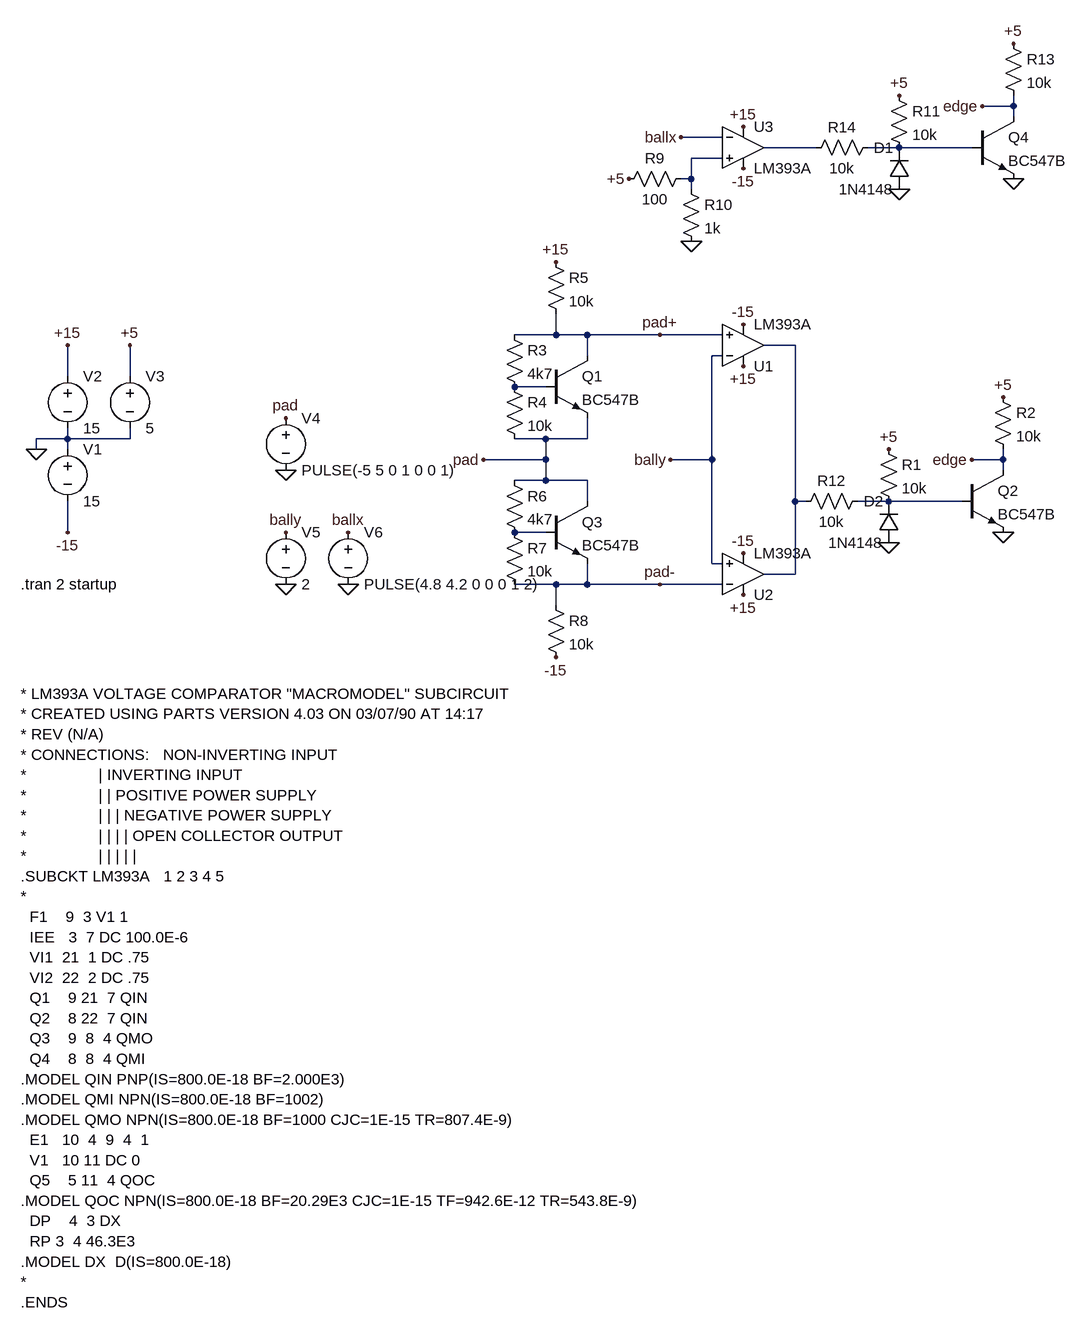
[diagram p0: schematic pad_area.asc]
pad_area.asc, the LTspice schematic file:
Version 4
SHEET 1 1728 1700
WIRE 1280 -368 1280 -384
WIRE 1280 -368 1232 -368
WIRE 1280 -352 1280 -368
WIRE 832 -320 768 -320
WIRE 976 -304 896 -304
WIRE 1104 -304 1056 -304
WIRE 1216 -304 1104 -304
WIRE 832 -288 784 -288
WIRE 784 -256 784 -288
WIRE 784 -256 768 -256
WIRE 784 -240 784 -256
WIRE 576 -16 576 -48
WIRE 576 -16 512 -16
WIRE 624 -16 576 -16
WIRE 736 -16 624 -16
WIRE 832 -16 736 -16
WIRE 944 0 896 0
WIRE 624 16 624 -16
WIRE 832 16 816 16
WIRE -176 48 -176 0
WIRE -80 48 -80 0
WIRE 560 64 512 64
WIRE -176 144 -176 128
WIRE -176 144 -224 144
WIRE -80 144 -80 128
WIRE -80 144 -176 144
WIRE 560 144 512 144
WIRE 624 144 624 112
WIRE 624 144 560 144
WIRE -224 160 -224 144
WIRE -176 160 -176 144
WIRE 560 176 560 144
WIRE 560 176 464 176
WIRE 816 176 816 16
WIRE 816 176 752 176
WIRE 1264 176 1264 160
WIRE 1264 176 1216 176
WIRE 1264 192 1264 176
WIRE 560 208 560 176
WIRE 560 208 512 208
WIRE 624 208 560 208
WIRE 624 240 624 208
WIRE 944 240 944 0
WIRE 960 240 944 240
WIRE 1088 240 1040 240
WIRE 1200 240 1088 240
WIRE -176 288 -176 240
WIRE 560 288 512 288
WIRE 816 336 816 176
WIRE 832 336 816 336
WIRE 944 352 944 240
WIRE 944 352 896 352
WIRE 576 368 512 368
WIRE 624 368 624 336
WIRE 624 368 576 368
WIRE 736 368 624 368
WIRE 832 368 736 368
WIRE 576 400 576 368
FLAG -224 160 0
FLAG -176 0 +15
FLAG -176 288 -15
FLAG 864 320 -15
FLAG 864 -32 -15
FLAG 864 32 +15
FLAG 864 384 +15
FLAG 1264 288 0
FLAG -80 0 +5
FLAG 1088 160 +5
FLAG 1264 80 +5
FLAG 576 -128 +15
FLAG 576 480 -15
FLAG 464 176 pad
FLAG 752 176 bally
FLAG 1216 176 edge
FLAG 160 192 0
FLAG 160 112 pad
FLAG 160 368 0
FLAG 160 288 bally
FLAG 736 -16 pad+
FLAG 736 368 pad-
FLAG 864 -272 -15
FLAG 864 -336 +15
FLAG 768 -320 ballx
FLAG 256 368 0
FLAG 256 288 ballx
FLAG 784 -160 0
FLAG 688 -256 +5
FLAG 1088 304 0
FLAG 1280 -256 0
FLAG 1104 -384 +5
FLAG 1280 -464 +5
FLAG 1232 -368 edge
FLAG 1104 -240 0
SYMBOL voltage -176 144 R0
SYMATTR InstName V1
SYMATTR Value 15
SYMBOL voltage -176 32 R0
SYMATTR InstName V2
SYMATTR Value 15
SYMBOL npn 560 16 R0
SYMATTR InstName Q1
SYMATTR Value BC547B
SYMBOL Opamps\\opamp2 864 64 M180
SYMATTR InstName U1
SYMATTR Value LM393A
SYMBOL Opamps\\opamp2 864 416 M180
SYMATTR InstName U2
SYMATTR Value LM393A
SYMBOL npn 1200 192 R0
SYMATTR InstName Q2
SYMATTR Value BC547B
SYMBOL res 1072 144 R0
SYMATTR InstName R1
SYMATTR Value 10k
SYMBOL voltage -80 32 R0
SYMATTR InstName V3
SYMATTR Value 5
SYMBOL res 1248 64 R0
SYMATTR InstName R2
SYMATTR Value 10k
SYMBOL res 496 -32 R0
SYMATTR InstName R3
SYMATTR Value 4k7
SYMBOL res 496 48 R0
SYMATTR InstName R4
SYMATTR Value 10k
SYMBOL res 560 -144 R0
SYMATTR InstName R5
SYMATTR Value 10k
SYMBOL npn 560 240 R0
SYMATTR InstName Q3
SYMATTR Value BC547B
SYMBOL res 496 192 R0
SYMATTR InstName R6
SYMATTR Value 4k7
SYMBOL res 496 272 R0
SYMATTR InstName R7
SYMATTR Value 10k
SYMBOL res 560 384 R0
SYMATTR InstName R8
SYMATTR Value 10k
SYMBOL voltage 160 96 R0
WINDOW 123 0 0 Left 0
WINDOW 39 0 0 Left 0
SYMATTR InstName V4
SYMATTR Value PULSE(-5 5 0 1 0 0 1)
SYMBOL voltage 160 272 R0
SYMATTR InstName V5
SYMATTR Value 2
SYMBOL Opamps\\opamp2 864 -368 R0
SYMATTR InstName U3
SYMATTR Value LM393A
SYMBOL voltage 256 272 R0
WINDOW 123 0 0 Left 0
WINDOW 39 0 0 Left 0
SYMATTR InstName V6
SYMATTR Value PULSE(4.8 4.2 0 0 0 1 2)
SYMBOL res 784 -272 R90
WINDOW 0 0 56 VBottom 2
WINDOW 3 32 56 VTop 2
SYMATTR InstName R9
SYMATTR Value 100
SYMBOL res 768 -256 R0
SYMATTR InstName R10
SYMATTR Value 1k
SYMBOL diode 1104 304 R180
WINDOW 0 24 64 Left 2
WINDOW 3 24 0 Left 2
SYMATTR InstName D2
SYMATTR Value 1N4148
SYMBOL res 1056 224 R90
WINDOW 0 0 56 VBottom 2
WINDOW 3 32 56 VTop 2
SYMATTR InstName R12
SYMATTR Value 10k
SYMBOL npn 1216 -352 R0
SYMATTR InstName Q4
SYMATTR Value BC547B
SYMBOL res 1088 -400 R0
SYMATTR InstName R11
SYMATTR Value 10k
SYMBOL res 1264 -480 R0
SYMATTR InstName R13
SYMATTR Value 10k
SYMBOL diode 1120 -240 R180
WINDOW 0 24 64 Left 2
WINDOW 3 24 0 Left 2
SYMATTR InstName D1
SYMATTR Value 1N4148
SYMBOL res 1072 -320 R90
WINDOW 0 0 56 VBottom 2
WINDOW 3 32 56 VTop 2
SYMATTR InstName R14
SYMATTR Value 10k
TEXT -248 368 Left 2 !.tran 2 startup
TEXT -248 536 Left 2 !* LM393A VOLTAGE COMPARATOR "MACROMODEL" SUBCIRCUIT\n* CREATED USING PARTS VERSION 4.03 ON 03/07/90 AT 14:17\n* REV (N/A)\n* CONNECTIONS:   NON-INVERTING INPUT\n*                | INVERTING INPUT\n*                | | POSITIVE POWER SUPPLY\n*                | | | NEGATIVE POWER SUPPLY\n*                | | | | OPEN COLLECTOR OUTPUT\n*                | | | | |\n.SUBCKT LM393A   1 2 3 4 5\n*\n  F1    9  3 V1 1\n  IEE   3  7 DC 100.0E-6\n  VI1  21  1 DC .75\n  VI2  22  2 DC .75\n  Q1    9 21  7 QIN\n  Q2    8 22  7 QIN\n  Q3    9  8  4 QMO\n  Q4    8  8  4 QMI\n.MODEL QIN PNP(IS=800.0E-18 BF=2.000E3)\n.MODEL QMI NPN(IS=800.0E-18 BF=1002)\n.MODEL QMO NPN(IS=800.0E-18 BF=1000 CJC=1E-15 TR=807.4E-9)\n  E1   10  4  9  4  1\n  V1   10 11 DC 0\n  Q5    5 11  4 QOC\n.MODEL QOC NPN(IS=800.0E-18 BF=20.29E3 CJC=1E-15 TF=942.6E-12 TR=543.8E-9)\n  DP    4  3 DX\n  RP 3  4 46.3E3\n.MODEL DX  D(IS=800.0E-18)\n*\n.ENDS

The netlist it stands for:
* pad_area.asc
V1 0 -15 15
V2 +15 0 15
Q1 pad+ N005 pad 0 BC547B
XU1 pad+ bally +15 -15 N004 LM393A  ; pins In+ In- V+ V- OUT
XU2 bally pad- +15 -15 N004 LM393A  ; pins In+ In- V+ V- OUT
Q2 edge N006 0 0 BC547B
R1 +5 N006 10k
V3 +5 0 5
R2 +5 edge 10k
R3 pad+ N005 4k7
R4 N005 pad 10k
R5 +15 pad+ 10k
Q3 pad N007 pad- 0 BC547B
R6 pad N007 4k7
R7 N007 pad- 10k
R8 pad- -15 10k
V4 pad 0 PULSE(-5 5 0 1 0 0 1)
V5 bally 0 2
XU3 N003 ballx +15 -15 N001 LM393A  ; pins In+ In- V+ V- OUT
V6 ballx 0 PULSE(4.8 4.2 0 0 0 1 2)
R9 N003 +5 100
R10 N003 0 1k
D2 0 N006 1N4148
R12 N006 N004 10k
Q4 edge N002 0 0 BC547B
R11 +5 N002 10k
R13 +5 edge 10k
D1 0 N002 1N4148
R14 N002 N001 10k
.model D D
.lib standard.dio
.model NPN NPN
.model PNP PNP
.lib standard.bjt
.tran 2 startup
* LM393A VOLTAGE COMPARATOR "MACROMODEL" SUBCIRCUIT
* CREATED USING PARTS VERSION 4.03 ON 03/07/90 AT 14:17
* REV (N/A)
* CONNECTIONS:   NON-INVERTING INPUT
*                | INVERTING INPUT
*                | | POSITIVE POWER SUPPLY
*                | | | NEGATIVE POWER SUPPLY
*                | | | | OPEN COLLECTOR OUTPUT
*                | | | | |
.SUBCKT LM393A   1 2 3 4 5
*
  F1    9  3 V1 1
  IEE   3  7 DC 100.0E-6
  VI1  21  1 DC .75
  VI2  22  2 DC .75
  Q1    9 21  7 QIN
  Q2    8 22  7 QIN
  Q3    9  8  4 QMO
  Q4    8  8  4 QMI
.MODEL QIN PNP(IS=800.0E-18 BF=2.000E3)
.MODEL QMI NPN(IS=800.0E-18 BF=1002)
.MODEL QMO NPN(IS=800.0E-18 BF=1000 CJC=1E-15 TR=807.4E-9)
  E1   10  4  9  4  1
  V1   10 11 DC 0
  Q5    5 11  4 QOC
.MODEL QOC NPN(IS=800.0E-18 BF=20.29E3 CJC=1E-15 TF=942.6E-12 TR=543.8E-9)
  DP    4  3 DX
  RP 3  4 46.3E3
.MODEL DX  D(IS=800.0E-18)
*
.ENDS
.backanno
.end